# EAGLE design untitled (EAGLE 8.2.2)
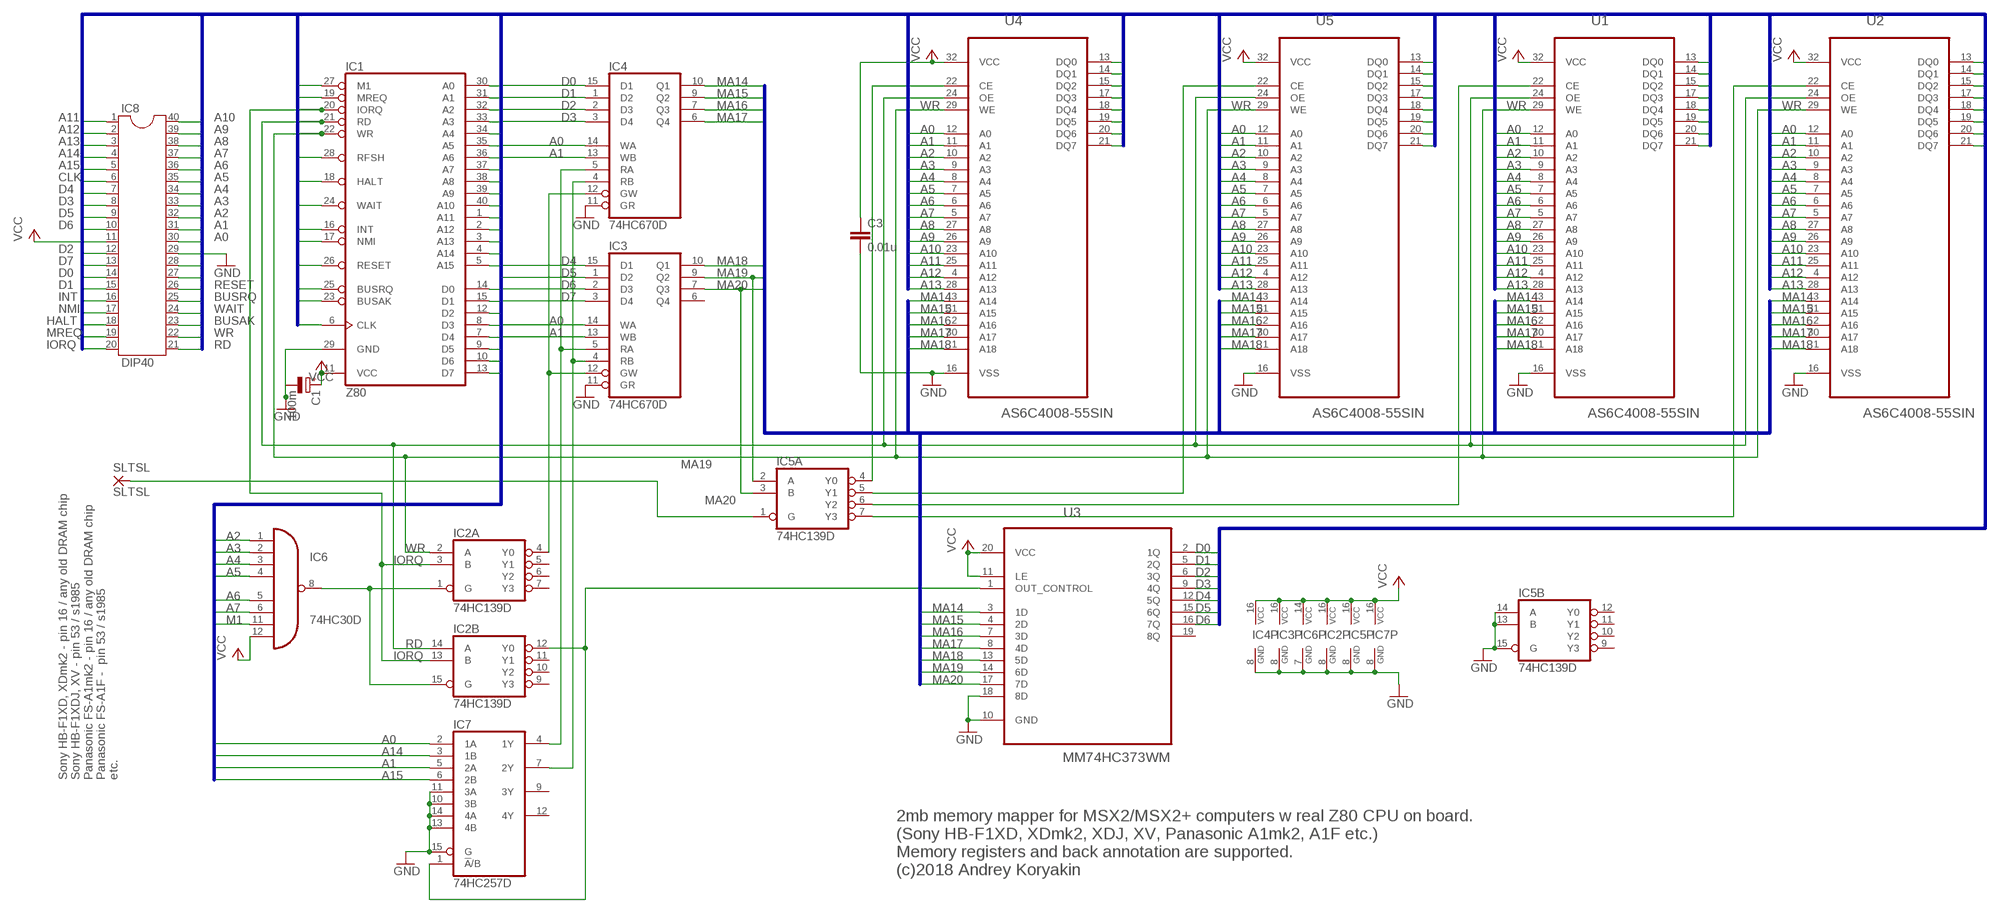
[diagram p0: schematic, sheet 1]

## Parts
C1  100m  CPOL-EUE2.5-5  [E2,5-5]
C3  0.01u  C2.5/2  [C2.5-2]
IC1  Z80  Z80CPU  [DIL40]
IC2  74HC139D  [SO16]
IC3  74HC670D  [SO16]
IC4  74HC670D  [SO16]
IC5  74HC139D  [SO16]
IC6  74HC30D  [SO14]
IC7  74HC257D  [SO16]
IC8  DIP40  DIL40  [DIL40]
SLTSL  SLTSL  WIREPAD1,6/0,8  [1,6/0,8]
U1  AS6C4008-55SIN  [SOIC127P1407X299-32N]
U2  AS6C4008-55SIN  [SOIC127P1407X299-32N]
U3  MM74HC373WM  [SOIC127P1032X265-20N]
U4  AS6C4008-55SIN  [SOIC127P1407X299-32N]
U5  AS6C4008-55SIN  [SOIC127P1407X299-32N]

## Nets
A0: IC1.30(A0) IC3.14(WA) IC4.14(WA) IC7.2(1A) IC8.30 U1.12(A0) U2.12(A0) U4.12(A0) U5.12(A0)
A1: IC1.31(A1) IC3.13(WB) IC4.13(WB) IC7.5(2A) IC8.31 U1.11(A1) U2.11(A1) U4.11(A1) U5.11(A1)
A2: IC1.32(A2) IC6.1(I0) IC8.32 U1.10(A2) U2.10(A2) U4.10(A2) U5.10(A2)
A3: IC1.33(A3) IC6.2(I1) IC8.33 U1.9(A3) U2.9(A3) U4.9(A3) U5.9(A3)
A4: IC1.34(A4) IC6.3(I2) IC8.34 U1.8(A4) U2.8(A4) U4.8(A4) U5.8(A4)
A5: IC1.35(A5) IC6.4(I3) IC8.35 U1.7(A5) U2.7(A5) U4.7(A5) U5.7(A5)
A6: IC1.36(A6) IC6.5(I4) IC8.36 U1.6(A6) U2.6(A6) U4.6(A6) U5.6(A6)
A7: IC1.37(A7) IC6.6(I5) IC8.37 U1.5(A7) U2.5(A7) U4.5(A7) U5.5(A7)
A8: IC1.38(A8) IC8.38 U1.27(A8) U2.27(A8) U4.27(A8) U5.27(A8)
A9: IC1.39(A9) IC8.39 U1.26(A9) U2.26(A9) U4.26(A9) U5.26(A9)
A10: IC1.40(A10) IC8.40 U1.23(A10) U2.23(A10) U4.23(A10) U5.23(A10)
A11: IC1.1(A11) IC8.1 U1.25(A11) U2.25(A11) U4.25(A11) U5.25(A11)
A12: IC1.2(A12) IC8.2 U1.4(A12) U2.4(A12) U4.4(A12) U5.4(A12)
A13: IC1.3(A13) IC8.3 U1.28(A13) U2.28(A13) U4.28(A13) U5.28(A13)
A14: IC1.4(A14) IC7.3(1B) IC8.4
A15: IC1.5(A15) IC7.6(2B) IC8.5
BUSAK: IC1.23(BUSAK) IC8.23
BUSRQ: IC1.25(BUSRQ) IC8.25
CLK: IC1.6(CLK) IC8.6
D0: IC1.14(D0) IC4.15(D1) IC8.14 U1.13(DQ0) U2.13(DQ0) U3.2(1Q) U4.13(DQ0) U5.13(DQ0)
D1: IC1.15(D1) IC4.1(D2) IC8.15 U1.14(DQ1) U2.14(DQ1) U3.5(2Q) U4.14(DQ1) U5.14(DQ1)
D2: IC1.12(D2) IC4.2(D3) IC8.12 U1.15(DQ2) U2.15(DQ2) U3.6(3Q) U4.15(DQ2) U5.15(DQ2)
D3: IC1.8(D3) IC4.3(D4) IC8.8 U1.17(DQ3) U2.17(DQ3) U3.9(4Q) U4.17(DQ3) U5.17(DQ3)
D4: IC1.7(D4) IC3.15(D1) IC8.7 U1.18(DQ4) U2.18(DQ4) U3.12(5Q) U4.18(DQ4) U5.18(DQ4)
D5: IC1.9(D5) IC3.1(D2) IC8.9 U1.19(DQ5) U2.19(DQ5) U3.15(6Q) U4.19(DQ5) U5.19(DQ5)
D6: IC1.10(D6) IC3.2(D3) IC8.10 U1.20(DQ6) U2.20(DQ6) U3.16(7Q) U4.20(DQ6) U5.20(DQ6)
D7: IC1.13(D7) IC3.3(D4) IC8.13 U1.21(DQ7) U2.21(DQ7) U4.21(DQ7) U5.21(DQ7)
GND [vcc]: C1.- C3.2 IC1.29(GND) IC2.8(P:GND) IC3.8(GND) IC3.11(GR) IC4.8(GND) IC4.11(GR) IC5.8(P:GND) IC5.13(B:B) IC5.14(B:A) IC5.15(B:G) IC6.7(GND) IC7.8(GND) IC7.10(3B) IC7.11(3A) IC7.13(4B) IC7.14(4A) IC7.15(G) IC8.29 U1.16(VSS) U2.16(VSS) U3.10(GND) U3.18(8D) U4.16(VSS) U5.16(VSS)
HALT: IC1.18(HALT) IC8.18
INT: IC1.16(INT) IC8.16
IORQ: IC1.20(IORQ) IC2.3(A:B) IC2.13(B:B) IC8.20
M1: IC1.27(M1) IC6.11(I6) IC8.27
MA14: IC4.10(Q1) U1.3(A14) U2.3(A14) U3.3(1D) U4.3(A14) U5.3(A14)
MA15: IC4.9(Q2) U1.31(A15) U2.31(A15) U3.4(2D) U4.31(A15) U5.31(A15)
MA16: IC4.7(Q3) U1.2(A16) U2.2(A16) U3.7(3D) U4.2(A16) U5.2(A16)
MA17: IC4.6(Q4) U1.30(A17) U2.30(A17) U3.8(4D) U4.30(A17) U5.30(A17)
MA18: IC3.10(Q1) U1.1(A18) U2.1(A18) U3.13(5D) U4.1(A18) U5.1(A18)
MA19: IC3.9(Q2) IC5.2(A:A) U3.14(6D)
MA20: IC3.7(Q3) IC5.3(A:B) U3.17(7D)
MREQ: IC1.19(MREQ) IC8.19
N$1: IC2.12(B:Y0) IC7.1(!A!/B) U3.1(OUT_CONTROL)
N$2: IC5.6(A:Y2) U1.22(CE)
N$3: IC5.7(A:Y3) U2.22(CE)
N$4: IC3.5(RA) IC4.5(RA) IC7.4(1Y)
N$5: IC5.4(A:Y0) U4.22(CE)
N$6: IC5.5(A:Y1) U5.22(CE)
N$7: IC3.4(RB) IC4.4(RB) IC7.7(2Y)
N$9: IC2.1(A:G) IC2.15(B:G) IC6.8(O)
N$12: IC2.4(A:Y0) IC3.12(GW) IC4.12(GW)
N$13: IC5.1(A:G) SLTSL.1(P)
NMI: IC1.17(NMI) IC8.17
RD: IC1.21(RD) IC2.14(B:A) IC8.21 U1.24(OE) U2.24(OE) U4.24(OE) U5.24(OE)
RESET: IC1.26(RESET) IC8.26
RFSH: IC1.28(RFSH) IC8.28
VCC [vcc]: C1.+ C3.1 IC1.11(VCC) IC2.16(P:VCC) IC3.16(VCC) IC4.16(VCC) IC5.16(P:VCC) IC6.12(I7) IC6.14(VCC) IC7.16(VCC) IC8.11 U1.32(VCC) U2.32(VCC) U3.11(LE) U3.20(VCC) U4.32(VCC) U5.32(VCC)
WAIT: IC1.24(WAIT) IC8.24
WR: IC1.22(WR) IC2.2(A:A) IC8.22 U1.29(WE) U2.29(WE) U4.29(WE) U5.29(WE)
Unconnected: IC2.5(A:Y1) IC2.6(A:Y2) IC2.7(A:Y3) IC2.9(B:Y3) IC2.10(B:Y2) IC2.11(B:Y1) IC3.6(Q4) IC5.9(B:Y3) IC5.10(B:Y2) IC5.11(B:Y1) IC5.12(B:Y0) IC7.9(3Y) IC7.12(4Y) U3.19(8Q)

## Buses
B$1,MA[14..20]
B$2,A[0..15],D[0..7],M1,MREQ,IORQ,RD,WR,RFSH,HALT,WAIT,INT,NMI,RESET,BUSRQ,BUSAK,CLK

## Notes on the sheet
- Sony HB-F1XD, XDmk2 - pin 16 / any old DRAM chip
  Sony HB-F1XDJ, XV - pin 53 / s1985
  Panasonic FS-A1mk2 - pin 16 / any old DRAM chip
  Panasonic FS-A1F -  pin 53 / s1985
  etc.
- 2mb memory mapper for MSX2/MSX2+ computers w real Z80 CPU on board.
  (Sony HB-F1XD, XDmk2, XDJ, XV, Panasonic A1mk2, A1F etc.)
  Memory registers and back annotation are supported.
  (c)2018 Andrey Koryakin

## Library data of the parts
C1 = resistor:CPOL-EU: POLARIZED CAPACITOR, European symbol
C3 = capacitor-wima:C: CAPACITOR naming: grid - package width
IC1 = zilog:Z80CPU: Z80 FAMILY DEVICE
IC2 IC5 = 74xx-eu:74*139: Dual 2-line to 4-line DECODER/DEMULTIPLEXER
IC3 IC4 = 74xx-eu:74*670: 4 by 4 REGISTER FILES, 3-state
IC6 = 74xx-eu:74*30: 8-input NAND gate
IC7 = 74xx-eu:74*257: Quadruple 2-to 1 line data SELECTOR/MULTIPLEXER
IC8 = ic-package:DIL40: Dual In Line
SLTSL = wirepad:WIREPAD: Wire PAD connect wire on PCB
U1 U2 U4 U5 = Alliance_Memory_By_element14_Batch_1:AS6C4008-55SIN: CMOS SRAM; MPN: AS6C4008-55SIN; OC_FARNELL: 1562901; OC_NEWARK: 94M6218; PACKAGE: SO-32; SUPPLIER: ALLIANCE MEMORY
U3 = Fairchild_By_element14_Batch_1:MM74HC373WM: 3-STATE Octal D-Type Latch; MPN: MM74HC373WM; OC_FARNELL: 1013976; OC_NEWARK: 78K6072; PACKAGE: SOIC-20; SUPPLIER: Fairchild

## Net classes
1 vcc: width 0.6 mm

## Board
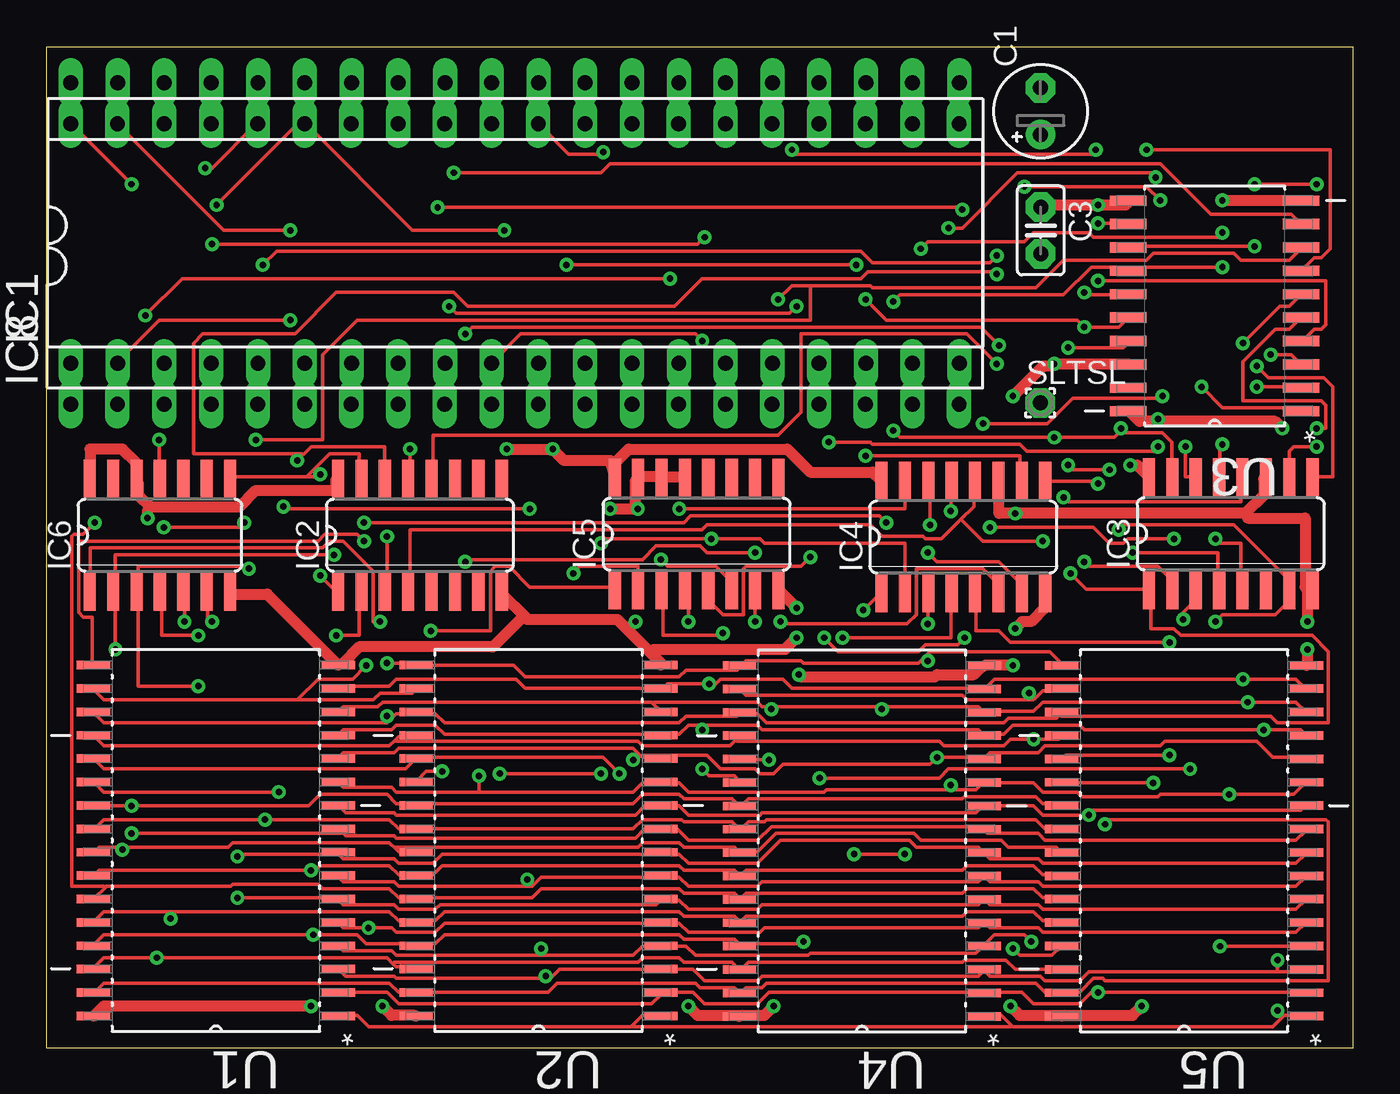
[diagram p1: board, top side]
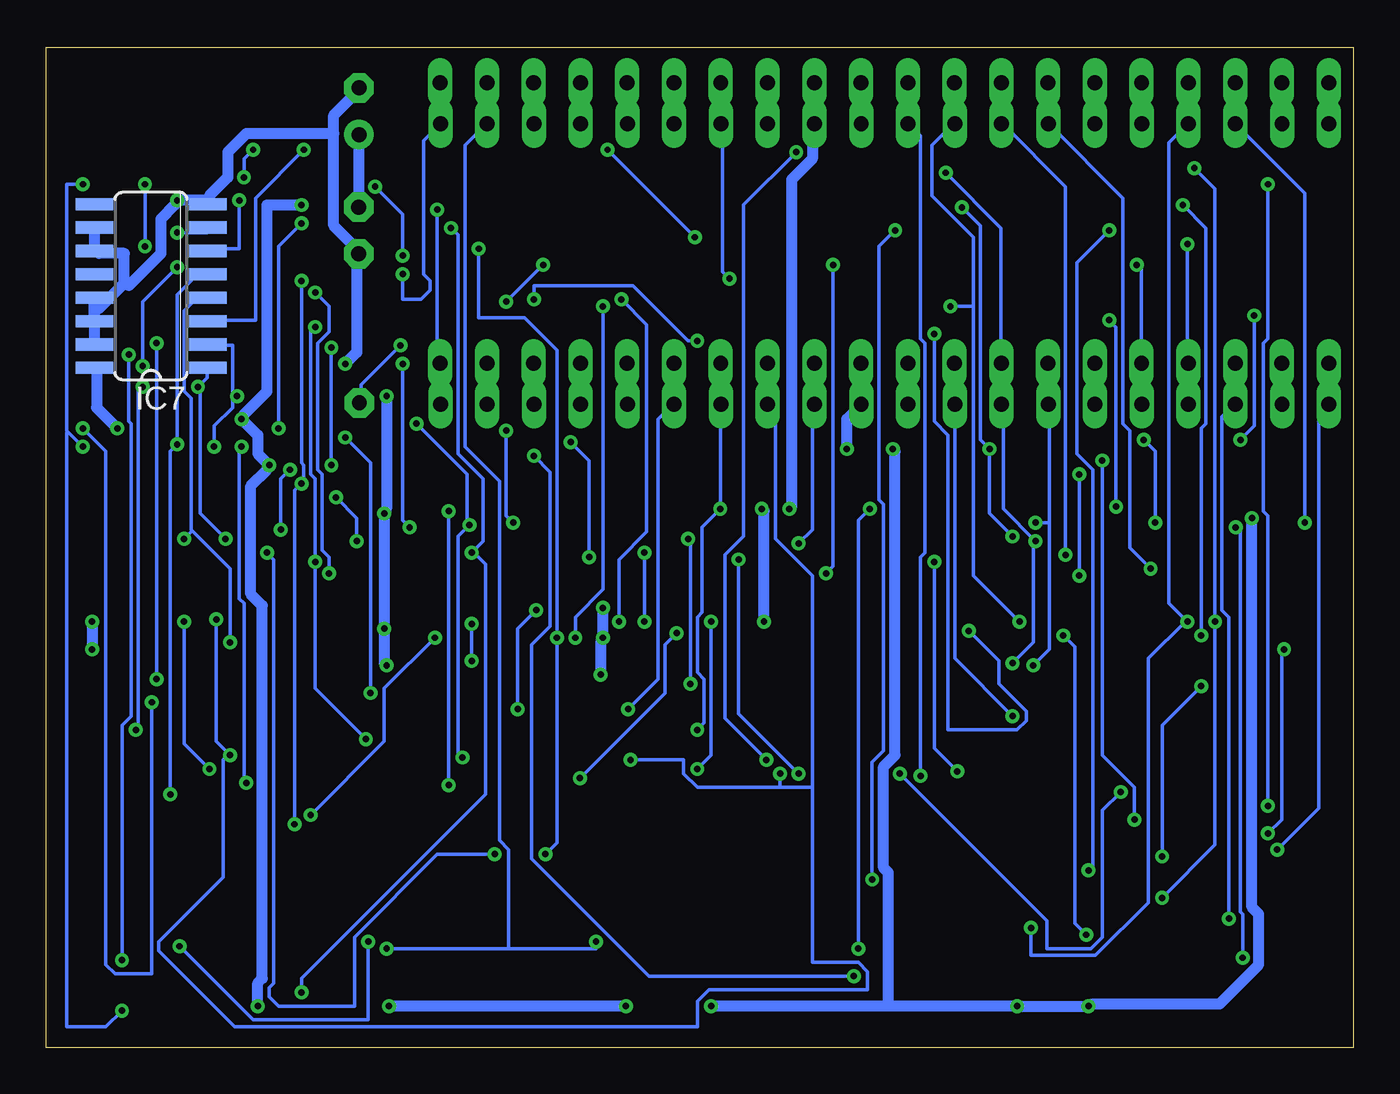
[diagram p2: board, bottom side, seen from below]

Size 71.02 x 54.32 mm. Coordinates in mm from the lower left corner, seen from the top.
Outline: 0.02,0 71.02,0 71,54.32 0,54.32 0.02,0
Copper layers (1*16): Top 0.035mm / dielectric 1.5mm / Bottom 0.035mm
Design rules "default *": minimum track width 7mil, minimum drill 0.35mm, track to track 7mil, track to pad 7mil, pad to pad 8mil, via to via 7mil, smd to smd 7mil, copper to edge 40mil, drill to drill 8mil, minimum pad ring 10mil, minimum via ring 8mil, stop-mask expansion 4mil, vias tented up to drill 0mil, thermal gap 10mil

### Footprints (pad centres in the part's own frame; a part is rotated, then mirrored left to right if it is on the bottom)
E2,5-5 = drill 0.813 pad 1.6: + -1.27,0 | drill 0.813 pad 1.6 octagon: - 1.27,0
C2.5-2 = drill 0.813 pad 1.6 octagon: 1 -1.27,0; 2 1.27,0
DIL40 = drill 0.813 long: 1 -24.13,-7.62; 2 -21.59,-7.62; 3 -19.05,-7.62; 4 -16.51,-7.62; 5 -13.97,-7.62; 6 -11.43,-7.62; 7 -8.89,-7.62; 8 -6.35,-7.62; 9 -3.81,-7.62; 10 -1.27,-7.62; 11 1.27,-7.62; 12 3.81,-7.62; 13 6.35,-7.62; 14 8.89,-7.62; 15 11.43,-7.62; 16 13.97,-7.62; 17 16.51,-7.62; 18 19.05,-7.62; 19 21.59,-7.62; 20 24.13,-7.62; 21 24.13,7.62; 22 21.59,7.62; 23 19.05,7.62; 24 16.51,7.62; 25 13.97,7.62; 26 11.43,7.62; 27 8.89,7.62; 28 6.35,7.62; 29 3.81,7.62; 30 1.27,7.62; 31 -1.27,7.62; 32 -3.81,7.62; 33 -6.35,7.62; 34 -8.89,7.62; 35 -11.43,7.62; 36 -13.97,7.62; 37 -16.51,7.62; 38 -19.05,7.62; 39 -21.59,7.62; 40 -24.13,7.62
SO16 = smd 0.66 x 2.032: 1 -4.445,-3.073; 2 -3.175,-3.073; 3 -1.905,-3.073; 4 -0.635,-3.073; 5 0.635,-3.073; 6 1.905,-3.073; 7 3.175,-3.073; 8 4.445,-3.073; 9 4.445,3.073; 10 3.175,3.073; 11 1.905,3.073; 12 0.635,3.073; 13 -0.635,3.073; 14 -1.905,3.073; 15 -3.175,3.073; 16 -4.445,3.073
SO14 = smd 0.66 x 2.032: 1 -3.81,-3.073; 2 -2.54,-3.073; 3 -1.27,-3.073; 4 0,-3.073; 5 1.27,-3.073; 6 2.54,-3.073; 7 3.81,-3.073; 8 3.81,3.073; 9 2.54,3.073; 10 1.27,3.073; 11 0,3.073; 12 -1.27,3.073; 13 -2.54,3.073; 14 -3.81,3.073
1,6/0,8 = drill 0.813 pad 1.6 octagon: 1 0,0
SOIC127P1407X299-32N = smd 1.803 x 0.457: 1 -6.655,9.525; 2 -6.655,8.255; 3 -6.655,6.985; 4 -6.655,5.715; 5 -6.655,4.445; 6 -6.655,3.175; 7 -6.655,1.905; 8 -6.655,0.635; 9 -6.655,-0.635; 10 -6.655,-1.905; 11 -6.655,-3.175; 12 -6.655,-4.445; 13 -6.655,-5.715; 14 -6.655,-6.985; 15 -6.655,-8.255; 16 -6.655,-9.525; 17 6.655,-9.525; 18 6.655,-8.255; 19 6.655,-6.985; 20 6.655,-5.715; 21 6.655,-4.445; 22 6.655,-3.175; 23 6.655,-1.905; 24 6.655,-0.635; 25 6.655,0.635; 26 6.655,1.905; 27 6.655,3.175; 28 6.655,4.445; 29 6.655,5.715; 30 6.655,6.985; 31 6.655,8.255; 32 6.655,9.525
SOIC127P1032X265-20N = smd 1.981 x 0.559: 1 -4.699,5.715; 2 -4.699,4.445; 3 -4.699,3.175; 4 -4.699,1.905; 5 -4.699,0.635; 6 -4.699,-0.635; 7 -4.699,-1.905; 8 -4.699,-3.175; 9 -4.699,-4.445; 10 -4.699,-5.715; 11 4.699,-5.715; 12 4.699,-4.445; 13 4.699,-3.175; 14 4.699,-1.905; 15 4.699,-0.635; 16 4.699,0.635; 17 4.699,1.905; 18 4.699,3.175; 19 4.699,4.445; 20 4.699,5.715

### Placement (x,y rotation side)
C1  54.02,50.84 90 top
C3  54.03,44.37 270 top
IC1  25.48,44.78 0 top
IC2  20.31,27.82 0 top
IC3  64.35,27.9 0 top
IC4  49.83,27.73 0 top
IC5  35.34,27.88 0 top
IC6  6.19,27.82 0 top
IC7  65.31,41.35 90 bottom
IC8  25.47,42.55 0 top
SLTSL  54,35 0 top
U1  9.23,11.24 180 top
U2  26.75,11.24 180 top
U3  63.48,40.27 180 top
U4  44.32,11.22 180 top
U5  61.82,11.23 180 top

### Tracks (layer width: path | path; a pad name or v marks a point on that pad's centre or on a via)
A0  (via drill 0.35)
  Top 0.178: v61.9,32.62 61.9,31 62.4,31 IC3.14 | U5.12 68.39,15.75 66.64,15.75 65.77,16.62 60.77,16.62 60.52,16.38 54.27,16.38 53.9,16 51.27,16 51.02,15.75 U4.12 50.9,15.75 v48.4,15.75 48.02,15.38 40.02,15.38 39.52,14.88 38.77,14.88 38.52,15.12 36.65,15.12 35.9,15.88 32.4,15.88 32.33,15.81 | v48.02,28.38 48.02,30.75 IC4.14 | v60.65,35.38 60.52,35.25 55.77,35.25 54.4,33.88 v50.9,33.88 | IC1.30 26.77,52.38 26.77,50.25 IC8.30 26.77,50.12 28.39,48.5 30.14,48.5 v30.27,48.62 | 32.33,15.81 32.4,15.75 33.4,15.75 U2.12 | 32.33,15.81 32.21,15.94 | 32.21,15.94 31.89,16.25 19.14,16.25 18.89,16 16.14,16 15.89,15.75 U1.12 | 32.21,15.94 v31.89,15.62
  Bottom 0.178: 60.9,35.38 60.9,34.75 61.9,33.75 v61.9,32.62 | 60.9,35.38 60.9,38.12 62.15,38.12 IC7.2 | v48.4,15.75 48.65,16 48.65,27.75 v48.02,28.38 48.15,28.38 48.15,31.12 v50.9,33.88 | v60.65,35.38 60.9,35.38 | v30.27,48.62 33.15,45.75 33.15,27.75 34.15,26.75 34.15,17.88 v31.89,15.62
A1  (via drill 0.35)
  Top 0.178: v63.9,32.75 63.77,32.75 63.77,31 IC3.13 | IC8.31 24.27,50.25 24.27,52.38 IC1.31 | 23.52,13.88 31.89,13.88 32.4,14.38 33.4,14.38 U2.11 33.52,14.38 34.4,14.38 34.9,13.88 42.27,13.88 42.4,14 49.15,14 | 23.52,13.88 19.02,13.88 18.77,14.12 16.14,14.12 15.89,14.38 U1.11 | 49.15,14 50.52,14 50.9,14.38 U4.11 51.02,14.38 53.65,14.38 54.15,13.88 56.02,13.88 56.27,13.62 60.4,13.62 60.52,13.75 v64.27,13.75 67.77,13.75 68.39,14.38 U5.11 | v49.15,29.12 49.15,30.75 IC4.13 | 49.15,14 v49.15,14.25 | 23.52,13.88 v23.52,14.75
  Bottom 0.178: IC7.5 62.27,41.88 62.9,41.88 63.9,40.88 v63.9,32.75 64.27,32.38 v64.27,13.75 | v49.15,14.25 v49.15,29.12 | v23.52,14.75 23.52,26.62 23.27,26.88 23.27,38.25 23.52,38.5 23.52,49.5 24.14,50.12 IC8.31
A2  (via drill 0.35)
  Top 0.178: v18.14,23.12 17.77,23.12 17.77,25.88 16.14,27.5 15.39,27.5 15.02,27.12 2.4,27.12 2.4,24.75 IC6.1 | IC1.32 21.64,52.38 21.64,50.25 IC8.32 | U1.10 15.89,13.12 16.27,12.75 18.89,12.75 19.02,12.62 32.02,12.62 32.52,13.12 33.4,13.12 U2.10 33.52,13.12 34.4,13.12 34.9,12.62 38.77,12.62 38.9,12.75 50.52,12.75 50.9,13.12 U4.10 53.65,13.12 54.15,12.62 56.27,12.62 56.46,12.81 | 56.46,12.81 56.52,12.88 68.14,12.88 68.39,13.12 U5.10 | v21.89,40.25 22.27,39.88 40.4,39.88 v40.77,40.25 | v42.27,22.25 43.02,21.5 47.4,21.5 47.77,21.88 49.52,21.88 v49.9,22.25 | 56.46,12.81 v56.65,12.62
  Bottom 0.178: v18.14,23.12 20.64,25.62 20.64,40.25 | 20.64,40.25 20.64,44 22.89,46.25 22.89,49 21.77,50.12 IC8.32 | v21.89,40.25 20.64,40.25 | v40.77,40.25 40.77,24.88 42.27,23.38 v42.27,22.25 | v49.9,22.25 52.65,19.5 52.65,16.62 v56.65,12.62
A3  (via drill 0.35)
  Top 0.178: v15.64,26.75 3.77,26.75 3.77,24.75 IC6.2 3.77,24.62 v3.77,21.62 | IC1.33 19.14,52.38 19.14,50.25 IC8.33 | U5.9 68.39,11.75 67.89,11.25 54.27,11.25 53.9,11.62 51.15,11.62 51.02,11.75 U4.9 50.9,11.88 50.77,12 39.4,12 38.65,11.25 34.9,11.25 34.27,11.88 U2.9 32.52,11.88 32.02,11.38 19.02,11.38 18.89,11.5 16.27,11.5 16.08,11.69 | 16.08,11.69 15.89,11.88 U1.9 | v4.64,11.62 16.02,11.62 16.08,11.69
  Bottom 0.178: v15.64,26.75 15.64,46.75 19.02,50.12 IC8.33 | v3.77,21.62 3.9,21.5 3.9,12.38 v4.64,11.62
A4  (via drill 0.35)
  Top 0.178: v11.02,26 10.89,26.12 5.02,26.12 5.02,24.75 IC6.3 5.02,24.62 5.02,19.62 v8.27,19.62 | IC1.34 16.64,52.38 16.64,50.25 IC8.34 | U5.8 68.39,10.5 67.89,10 54.15,10 53.9,10.25 51.27,10.25 51.02,10.5 U4.8 50.9,10.62 50.65,10.88 47.27,10.88 46.9,11.25 39.9,11.25 38.65,10 34.9,10 34.4,10.5 33.52,10.5 U2.8 33.4,10.5 21.52,10.5 21.02,10 19.14,10 18.89,10.25 16.14,10.25 15.89,10.5 U1.8 15.77,10.5 10.52,10.5 v10.39,10.38
  Bottom 0.178: v11.02,26 12.14,27.12 12.14,33.5 12.52,33.88 12.52,46.12 16.52,50.12 IC8.34 | v8.27,19.62 10.39,17.5 v10.39,10.38
A5  (via drill 0.35)
  Top 0.178: v8.27,22.38 6.27,22.38 6.27,24.62 IC6.4 | v9.27,45.75 13.64,50.12 14.02,50.12 IC8.35 | IC1.35 14.02,52.38 14.02,50.25 IC8.35 | U5.7 68.39,9.25 67.89,8.75 54.15,8.75 53.9,9 51.27,9 51.02,9.25 U4.7 50.9,9.25 50.65,9 38.9,9 38.65,8.75 34.9,8.75 34.4,9.25 33.52,9.25 U2.7 33.4,9.25 26.89,9.25 26.46,8.81 | 26.46,8.81 26.39,8.75 19.14,8.75 18.89,9 16.14,9 15.89,9.25 U1.7 | v24.89,44.38 19.89,44.38 14.14,50.12 IC8.35 | 26.46,8.81 v26.14,9.12
  Bottom 0.178: v8.27,22.38 8.27,33.62 8.02,33.88 8.02,44.5 v9.27,45.75 | v24.89,44.38 25.77,43.5 25.77,29.75 25.52,29.5 25.52,16.12 26.14,15.5 v26.14,9.12
A6  (via drill 0.35)
  Top 0.178: U5.6 68.39,8 67.89,7.5 54.15,7.5 53.9,7.75 51.27,7.75 51.02,8 U4.6 50.9,8 50.65,7.75 38.9,7.75 38.65,7.5 34.9,7.5 34.4,8 33.52,8 U2.6 33.4,8 33.15,7.75 21.39,7.75 21.14,7.5 19.14,7.5 18.89,7.75 16.14,7.75 15.89,8 U1.6 15.77,8.12 v10.39,8.12 | IC1.36 11.52,52.38 11.52,50.25 IC8.36 11.39,50.12 9.02,47.75 v8.64,47.75 | v7.52,23.12 7.52,24.62 IC6.5
  Bottom 0.178: v10.39,8.12 7.52,11 v7.52,23.12 7.52,46.62 v8.64,47.75
A7  (via drill 0.35)
  Top 0.178: v9.02,23.12 8.77,23.12 8.77,24.62 IC6.6 | IC1.37 9.02,52.38 9.02,50.25 IC8.37 | U5.5 68.39,6.75 67.89,6.25 54.15,6.25 53.9,6.5 51.27,6.5 51.02,6.75 U4.5 50.9,6.75 50.65,6.5 39.02,6.5 38.77,6.25 34.9,6.25 34.4,6.75 33.52,6.75 U2.5 33.4,6.75 21.64,6.75 21.14,6.25 19.02,6.25 18.77,6.5 v17.52,6.5 16.14,6.5 15.89,6.75 U1.5
  Bottom 0.178: IC8.37 9.02,50.12 10.02,49.12 10.02,24.12 v9.02,23.12 9.14,23.12 11.14,21.12 11.14,7.88 14.02,5 17.52,5 v17.52,6.5
A8  (via drill 0.35)
  Top 0.178: U5.27 55.15,8.12 54.15,8.12 53.65,8.62 50.02,8.62 49.77,8.38 38.02,8.38 37.77,8.12 U4.27 37.65,8.12 37.4,8.38 34.65,8.38 34.4,8.62 26.89,8.62 26.39,8.12 20.14,8.12 U2.27 20.02,8.12 19.14,8.12 18.64,8.62 15.02,8.62 14.77,8.88 10.14,8.88 10.02,8.75 3.27,8.75 3.21,8.69 | IC8.38 6.39,50.25 6.39,52.38 IC1.38 | 3.21,8.69 2.65,8.12 U1.27 | v2.65,28.5 2.02,27.88 1.52,27.88 1.4,27.75 1.4,8.75 3.15,8.75 3.21,8.69
  Bottom 0.178: v2.65,28.5 2.65,46.38 6.39,50.12 IC8.38
A9  (via drill 0.35)
  Top 0.178: U5.26 55.15,9.38 54.15,9.38 53.65,9.88 50.02,9.88 49.77,9.62 38.02,9.62 37.77,9.38 U4.26 37.65,9.38 37.4,9.62 34.65,9.62 34.4,9.88 21.52,9.88 21.02,9.38 20.14,9.38 U2.26 20.02,9.38 19.14,9.38 18.64,9.88 14.89,9.88 14.64,9.62 v14.39,9.62 2.9,9.62 2.65,9.38 U1.26 | IC1.39 3.9,52.38 3.9,50.25 IC8.39 3.9,50.12 9.64,44.38 v13.27,44.38
  Bottom 0.178: v13.27,44.38 15.02,42.62 15.02,32.25 14.14,31.38 14.14,9.88 v14.39,9.62
A10  (via drill 0.35)
  Top 0.178: U5.23 55.15,13.25 54.15,13.25 53.77,13.62 49.9,13.62 49.77,13.5 38.15,13.5 37.77,13.12 U4.23 37.65,13.12 37.27,13.5 34.65,13.5 34.4,13.75 32.4,13.75 31.89,13.25 20.14,13.25 U2.23 20.02,13.25 19.02,13.25 18.52,13.75 14.89,13.75 14.27,13.12 v4.64,13.12 2.65,13.12 U1.23 | IC1.40 1.4,52.38 1.4,50.25 IC8.40 1.4,50.12 v4.64,46.88
  Bottom 0.178: v4.64,46.88 4.64,38.5 4.89,38.25 4.89,29.12 4.64,28.88 v4.64,13.12
A11  (via drill 0.35)
  Top 0.178: IC8.1 1.4,35 1.4,37.12 IC1.1 | 4.14,10.88 9.89,10.88 10.14,11.12 18.64,11.12 18.96,10.81 | 4.14,10.88 2.9,10.88 2.65,10.62 U1.25 | 18.96,10.81 19.14,10.62 20.02,10.62 U2.25 | 18.96,10.81 19.02,10.88 32.15,10.88 32.4,11.12 34.4,11.12 34.65,10.88 37.4,10.88 37.65,10.62 U4.25 37.77,10.62 38.65,10.62 39.65,11.62 47.15,11.62 47.52,11.25 51.9,11.25 52.27,10.88 54.9,10.88 55.15,10.62 U5.25 | 4.14,10.88 v4.14,10.75
  Bottom 0.178: IC8.1 1.9,34.38 1.9,13 v4.14,10.75
A12  (via drill 0.35)
  Top 0.178: IC8.2 3.9,35 3.9,37.12 IC1.2 3.9,37.25 6.14,39.5 v13.27,39.5 | 26.89,5 31.89,5 32.4,5.5 33.4,5.5 U2.4 33.52,5.5 34.77,5.5 35.27,5 41.4,5 41.52,5.12 50.52,5.12 50.9,5.5 U4.4 51.02,5.62 51.52,6.12 53.15,6.12 v53.52,5.75 | 26.89,5 19.02,5 18.77,5.25 16.14,5.25 15.89,5.5 U1.4 | v63.77,5.5 68.39,5.5 U5.4 | v12.89,29.38 13.02,29.25 v26.27,29.25 | 26.89,5 v26.89,5.38
  Bottom 0.178: v63.77,5.5 59.77,1.5 53.52,1.5 v53.52,5.75 | v13.27,39.5 12.89,39.12 v12.89,29.38 | v26.27,29.25 26.89,28.62 v26.89,5.38
A13  (via drill 0.35)
  Top 0.178: U5.28 55.15,6.88 54.15,6.88 53.65,7.38 50.02,7.38 49.77,7.12 38.02,7.12 37.77,6.88 U4.28 37.65,6.88 37.4,7.12 34.65,7.12 34.4,7.38 21.64,7.38 21.14,6.88 20.14,6.88 U2.28 20.02,6.88 19.14,6.88 18.64,7.38 6.77,7.38 | IC8.3 6.39,35 6.39,37.12 IC1.3 | 6.77,7.38 3.15,7.38 2.65,6.88 U1.28 | 6.77,7.38 v6.77,7
  Bottom 0.178: v6.77,7 6.77,23.38 7.14,23.75 7.14,34.25 6.52,34.88 IC8.3
A14  (via drill 0.35)
  Top 0.178: v57.02,48.75 56.77,48.5 40.77,48.5 v40.52,48.75 | v35.77,44 35.4,43.62 v9.02,43.62 | IC8.4 9.02,35 9.02,37.12 IC1.4
  Bottom 0.178: v57.02,48.75 59.65,46.12 59.65,39.5 62.15,39.5 IC7.3 | v35.77,44 v40.52,48.75 | v9.02,43.62 9.02,37.25 IC1.4
A15  (via drill 0.35)
  Top 0.178: v60.52,46 59.77,46.75 v53.15,46.75 | v51.65,43 51.27,42.62 44.9,42.62 44.27,43.25 12.52,43.25 v11.77,42.5 | IC8.5 11.52,35 11.52,37.12 IC1.5
  Bottom 0.178: v60.52,46 60.52,43.38 62.15,43.38 IC7.6 | v53.15,46.75 51.65,45.25 v51.65,43 | v11.77,42.5 11.52,42.25 11.52,37.25 IC1.5
BUSAK
  Top 0.178: IC8.23 44.52,52.38 IC1.23
BUSRQ
  Top 0.178: IC8.25 39.52,50.25 39.52,52.38 IC1.25
CLK
  Top 0.178: IC8.6 14.02,35 14.02,37.12 IC1.6
D0  (via drill 0.35)
  Top 0.178: v34.4,29.25 46.65,29.25 46.65,30.75 IC4.15 | IC1.14 34.4,37.12 34.4,35 IC8.14 | 35.65,17.5 34.9,17.5 34.4,17 33.52,17 U2.13 33.4,17 21.64,17 21.14,17.5 19.02,17.5 18.77,17.25 16.14,17.25 15.89,17 U1.13 | 35.65,17.5 38.65,17.5 38.9,17.25 50.65,17.25 50.9,17 U4.13 51.02,17 52.02,17 52.52,17.5 56.15,17.5 56.4,17.25 v66.14,17.25 68.14,17.25 68.39,17 U5.13 | v65.77,35.88 68.14,35.88 U3.2 | 35.65,17.5 v35.65,17.25
  Bottom 0.178: IC8.14 34.4,34.88 v34.4,29.25 35.4,28.25 35.4,23.62 35.65,23.38 35.65,20.38 35.27,20 35.27,17.62 v35.65,17.25 | v65.77,35.88 66.02,35.62 66.02,17.38 v66.14,17.25
D1  (via drill 0.35)
  Top 0.178: IC8.15 36.9,35 36.9,37.12 IC1.15 | 32.96,18.69 33.4,18.25 U2.14 | 32.96,18.69 32.9,18.75 18.27,18.75 18.02,18.5 16.14,18.5 15.89,18.25 U1.14 | 39.4,18.5 38.9,18.5 38.65,18.75 33.02,18.75 32.96,18.69 | 39.4,18.5 45.4,18.5 | 45.4,18.5 50.65,18.5 50.9,18.25 U4.14 51.02,18.25 53.65,18.25 54.15,18.75 v65.27,18.75 67.89,18.75 68.39,18.25 U5.14 | v69.02,33.62 69.52,33.62 69.52,34.88 69.27,35.12 65.02,35.12 65.02,37.25 66.77,39 67.52,39 68.14,39.62 U3.5 | v44.4,23.75 45.27,24.62 IC4.1 | 45.4,18.5 v45.4,18.38 | 39.4,18.5 v39.4,18.38
  Bottom 0.178: v69.02,33.62 67.77,32.38 67.77,4.5 67.27,4 65.27,4 v65.27,18.75 | v44.4,23.75 45.4,22.75 v45.4,18.38 | v39.4,18.38 37.77,20 37.77,34.12 37.02,34.88 IC8.15
D2  (via drill 0.35)
  Top 0.178: v30.14,27.38 30.39,27.62 v36.15,27.62 38.77,27.62 39.02,27.38 46.65,27.38 46.65,24.75 IC4.2 | IC1.12 29.27,37.12 29.27,35 IC8.12 | U1.15 15.89,19.5 16.02,19.62 18.64,19.62 19.02,20 25.52,20 26.02,19.5 U2.15 33.52,19.5 33.77,19.75 v36.02,19.75 36.4,19.75 36.65,20 40.02,20 40.52,19.5 50.9,19.5 U4.15 51.02,19.5 51.52,20 v65.02,20 67.89,20 68.39,19.5 U5.15 | v65.02,38.25 67.02,40.25 67.52,40.25 68.14,40.88 U3.6
  Bottom 0.178: v30.14,27.38 29.39,28.12 29.39,34.88 IC8.12 | v65.02,20 v65.02,38.25 | v36.15,27.62 36.02,27.5 v36.02,19.75
D3  (via drill 0.35)
  Top 0.178: 47.71,21.19 47.4,20.88 41.15,20.88 41.02,21 38.02,21 37.77,20.75 U4.17 37.65,20.62 37.52,20.5 34.77,20.5 34.4,20.12 26.02,20.12 25.39,20.75 20.14,20.75 U2.17 20.02,20.88 v18.52,20.88 | 47.71,21.19 48.02,21.5 54.52,21.5 55.15,20.88 U5.17 | v47.9,23 47.9,24.62 IC4.3 | 47.71,21.19 v47.9,21 | v17.27,27.5 16.89,27.88 15.14,27.88 14.77,27.5 1.77,27.5 1.77,23.62 2.02,23.38 2.52,23.38 2.52,20.88 U1.17 | v22.14,47.5 30.14,47.5 30.64,48 60.52,48 63.27,45.25 67.64,45.25 68.14,44.75 U3.9 | IC8.8 19.14,35 19.14,37.12 IC1.8
  Bottom 0.178: v47.9,21 v47.9,23 | IC8.8 19.02,34.88 19.02,29.25 v17.27,27.5 17.39,27.5 17.39,22 v18.52,20.88 | v22.14,47.5 19.14,44.5 19.14,37.25 IC1.8
D4  (via drill 0.35)
  Top 0.178: IC8.7 16.64,35 16.64,37.12 IC1.7 | 13.64,18.88 17.77,18.88 18.14,19.25 19.89,19.25 20.02,19.38 U2.18 | 13.64,18.88 3.15,18.88 2.65,19.38 U1.18 | v17.39,20.75 16.64,20 14.77,20 13.64,18.88 | v57.15,44.75 58.77,44.75 U3.12 | IC3.15 61.15,31 61.15,32.88 60.65,33.38 58.65,33.38 v58.4,33.62 58.4,33.5 58.02,33.12 v54.77,33.12 46.4,33.12 v46.02,33.5 | 53.71,18.94 54.15,19.38 55.15,19.38 U5.18 | 53.71,18.94 53.65,18.88 50.02,18.88 49.77,19.12 38.02,19.12 37.77,19.38 U4.18 | 53.71,18.94 v53.4,19.25 | v17.27,28.5 34.65,28.5 35.02,28.88 45.27,28.88 v45.65,28.5
  Bottom 0.178: 16.52,28.5 16.52,21.62 v17.39,20.75 | 16.52,28.5 16.52,34.88 IC8.7 | v57.15,44.75 58.4,43.5 v58.4,33.62 | v54.77,33.12 53.4,31.75 v53.4,19.25 | v17.27,28.5 16.52,28.5 | v45.65,28.5 46.02,28.88 v46.02,33.5
D5  (via drill 0.35)
  Top 0.178: v56.4,41 56.52,40.88 58.77,40.88 U3.15 | v55.65,25.75 56.52,24.88 59.9,24.88 IC3.1 60.02,24.75 60.02,22.75 61.27,22.75 61.65,22.38 68.77,22.38 69.64,21.5 69.64,17.62 66.89,17.62 66.52,18 55.15,18 U5.19 55.15,18.12 54.9,17.88 52.27,17.88 52.02,17.62 39.15,17.62 38.65,18.12 37.77,18.12 U4.19 37.65,18.12 37.52,18 34.77,18 34.4,17.62 21.64,17.62 21.14,18.12 20.14,18.12 U2.19 20.02,18.12 19.02,18.12 18.71,17.81 | IC8.9 21.64,35 21.64,37.12 IC1.9 | 18.71,17.81 18.52,17.62 3.15,17.62 2.65,18.12 U1.19 | 18.71,17.81 v18.52,18
  Bottom 0.178: v56.4,41 55.65,40.25 55.65,38.88 56.27,38.25 56.27,31.38 56.02,31.12 56.02,27 55.65,26.62 v55.65,25.75 | v18.52,18 21.64,21.12 21.64,34.88 IC8.9
D6  (via drill 0.35)
  Top 0.178: 18.96,16.69 19.14,16.88 20.02,16.88 U2.20 | 18.96,16.69 18.64,16.38 3.15,16.38 2.65,16.88 U1.20 | 37.46,16.69 37.15,16.38 32.4,16.38 32.15,16.62 19.02,16.62 18.96,16.69 | 37.46,16.69 37.65,16.88 U4.20 | U5.20 55.15,16.88 55.02,16.75 v53.65,16.75 52.4,16.75 52.02,16.38 48.77,16.38 48.52,16.62 37.52,16.62 37.46,16.69 | IC8.10 24.27,35 24.27,37.12 IC1.10 24.27,37.25 25.77,38.75 35.27,38.75 v35.65,38.38 | v56.4,26.38 56.65,26.12 60.4,26.12 61.15,25.38 61.15,24.88 IC3.2 | U3.16 58.27,39.12 v56.4,39.12 56.02,39.5 45.65,39.5 v44.52,40.62
  Bottom 0.178: v56.4,39.12 56.65,38.88 56.65,31.12 56.4,30.88 v56.4,26.38 56.4,19.5 v53.65,16.75 | v35.65,38.38 36.15,38.38 39.15,41.38 44.52,41.38 v44.52,40.62
D7  (via drill 0.35)
  Top 0.178: U1.21 2.65,15.62 3.15,15.12 19.52,15.12 20.02,15.62 U2.21 20.14,15.75 30.27,15.75 v31.14,14.88 | v61.02,15.88 55.4,15.88 55.27,15.75 U5.21 | v61.77,23.25 61.77,23.62 62.4,24.25 62.4,24.75 IC3.3 | v39.27,15.62 37.77,15.62 U4.21 | IC1.13 31.89,37.12 31.89,35 IC8.13
  Bottom 0.178: v61.77,23.25 61.77,16.62 v61.02,15.88 61.15,15.88 61.4,15.62 61.4,9.25 64.89,5.75 64.89,5.25 60.77,1.12 35.65,1.12 35.65,2.5 35.02,3.12 26.39,3.12 26.39,4.12 26.89,4.62 29.39,4.62 29.39,14.12 | v39.27,15.62 36.4,15.62 36.4,14.88 35.65,14.12 31.14,14.12 | 29.39,14.12 31.14,14.12 | 29.39,14.12 29.39,25.62 31.39,27.62 31.39,34.5 31.77,34.88 IC8.13 | 31.14,14.12 v31.14,14.88
GND  (via drill 0.35)
  Top 0.6: v52.52,20.75 51.02,20.75 U4.16 50.77,20.62 50.4,20.25 48.4,20.25 48.27,20.12 41.02,20.12 v40.9,20.25 | v52.65,22.75 53.02,23.12 53.52,23.12 54.27,23.88 54.27,24.62 IC4.8 | v68.52,21.62 68.52,20.88 U5.16 | 68.52,24.75 v68.52,23.12 | 68.52,24.75 68.77,24.75 IC3.8 | 65.14,29 v52.65,29 51.77,29 51.77,30.75 IC4.11 | 65.14,29 66.14,30 66.14,30.88 IC3.11 | 68.52,24.75 68.39,25 68.39,28.75 65.27,28.75 65.14,29 | v63.9,46 68.14,46 U3.10 | U3.18 58.77,37.12 v54.77,37.12 54.52,37 54.15,37 v52.52,35.38 | IC5.13 34.65,31 33.65,31 IC5.14 33.4,31 32.27,31 IC5.15 32.02,30.75 32.02,29.25 | IC8.29 29.27,50.25 29.27,52.38 IC1.29 | v30.64,29.25 32.02,29.25 | IC6.7 10.02,24.62 12.02,24.62 15.77,20.88 U1.16 16.14,20.88 17.02,21.75 24.27,21.75 25.96,23.44 | 31.58,22.69 31.02,23.25 26.14,23.25 25.96,23.44 | 31.58,22.69 32.83,21.44 | 32.83,21.44 33.4,20.88 U2.16 | 25.96,23.44 24.77,24.62 IC2.8 | v40.77,23.88 39.9,24.75 IC5.8 | v40.77,22.25 40.15,21.62 33.02,21.62 32.83,21.44 | 31.58,22.69 v32.02,23.12 | v32.15,29.25 32.02,29.25
  Bottom 0.6: v52.52,20.75 52.65,20.88 v52.65,22.75 v52.65,29 52.52,29.25 v52.52,35.38 | v68.52,23.12 v68.52,21.62 | 62.27,46 v63.9,46 64.02,45.75 64.77,45 64.77,43.12 66.52,41.38 66.77,41.5 | 62.27,46 62.27,45.88 IC7.8 | IC7.10 68.39,44.5 68.39,43.38 IC7.11 68.14,43.12 66.77,43.12 66.77,41.5 | IC7.15 68.39,38.25 68.39,39.38 IC7.14 68.39,39.75 68.39,40.12 | 68.39,40.12 68.39,40.62 IC7.13 | 66.77,41.5 68.14,40.12 68.39,40.12 | v54.77,37.12 54.15,37.75 54.15,43 C3.2 54.15,43.38 55.4,44.62 55.4,49.62 | 55.4,49.62 55.4,50.62 54.02,52 C1.- | 55.4,49.62 60.15,49.62 61.15,48.62 61.15,47.25 62.15,46.25 62.27,46 | v30.64,29.25 30.52,29.38 30.52,47.12 29.39,48.25 29.39,50.12 IC8.29 | v40.77,23.88 v40.77,22.25 40.9,22 v40.9,20.25 | v32.15,29.25 32.02,29.12 v32.02,23.12
HALT
  Top 0.178: IC8.18 44.52,37.12 IC1.18
INT
  Top 0.178: IC8.16 39.52,35 39.52,37.12 IC1.16
IORQ  (via drill 0.35)
  Top 0.178: IC8.20 49.65,35 49.65,37.12 IC1.20 | v18.52,27.75 18.52,24.75 IC2.3 | v19.77,32.5 19.77,31 IC2.13 | v49.77,45.5 49.65,45.62 v21.27,45.62
  Bottom 0.178: v18.52,27.75 19.77,29 v19.77,32.5 20.27,33 20.27,44.62 v21.27,45.62 | v49.77,45.5 49.77,37.38 49.65,37.25 IC1.20
M1  (via drill 0.35)
  Top 0.178: v6.14,33 6.14,31 IC6.11 | v5.39,39.75 7.39,41.75 v33.9,41.75 | IC1.27 34.4,52.38 34.4,50.25 IC8.27
  Bottom 0.178: v6.14,33 5.39,33.75 v5.39,39.75 | v33.9,41.75 34.27,42.12 34.27,50.12 IC8.27
MA14  (via drill 0.35)
  Top 0.178: 66.89,4.12 68.39,4.12 U5.3 | 66.89,4.12 56.65,4.12 56.15,3.62 54.27,3.62 54.02,3.88 51.27,3.88 51.02,4.12 U4.3 50.9,4.12 50.65,3.88 38.9,3.88 38.65,3.62 35.77,3.62 35.15,4.25 33.52,4.25 U2.3 27.89,4.25 27.39,3.75 27.14,3.75 | v66.52,37.62 67.64,37.62 68.14,37.12 U3.3 | 66.89,4.12 v66.89,4.75 | 27.14,3.75 19.02,3.75 18.89,3.88 16.27,3.88 15.89,4.25 U1.3 | v44.52,32.12 52.9,32.12 52.9,30.88 IC4.10 | 27.14,3.75 v27.14,3.88
  Bottom 0.178: v66.52,37.62 66.52,34 66.39,33.88 66.39,18 66.89,17.5 v66.89,4.75 | v44.52,32.12 43.65,31.25 43.65,22.88 44.65,21.88 44.65,10.25 38.27,3.88 v27.14,3.88
MA15  (via drill 0.35)
  Top 0.178: v57.15,41.62 69.52,41.62 69.52,39.25 69.27,39 68.89,39 68.27,38.38 U3.4 | v57.15,30.62 57.02,30.75 54.4,30.75 IC4.9 | U1.31 2.65,3 3.15,3.5 18.64,3.5 19.14,3 20.02,3 U2.31 20.14,3 27.27,3 27.77,3.5 35.27,3.5 35.52,3.25 37.4,3.25 37.65,3 U4.31 37.77,3 38.02,3.25 38.9,3.25 39.15,3.5 53.77,3.5 54.27,3 55.15,3 U5.31 55.27,3 56.15,3 56.9,3.75 57.4,3.75 57.52,3.62 69.64,3.62 69.64,12.25 69.52,12.38 57.77,12.38 v57.52,12.12
  Bottom 0.178: v57.15,41.62 57.15,31.75 57.02,31.62 57.02,30.75 v57.15,30.62 57.52,30.25 v57.52,12.12
MA16  (via drill 0.35)
  Top 0.178: v59.77,48.75 69.77,48.75 69.77,43.38 69.27,42.88 68.89,42.88 68.27,42.25 U3.7 | v60.27,47.25 60.02,47.5 52.77,47.5 49.77,44.5 v49.02,44.5 | v47.9,26.88 48.4,26.38 51.77,26.38 52.9,25.25 52.9,24.75 IC4.7 | U1.2 15.89,3 18.52,3 19.14,2.38 32.9,2.38 33.4,2.88 U2.2 33.52,3 35.15,3 35.77,2.38 38.65,2.38 39.27,3 50.9,3 U4.2 51.02,3 53.02,3 53.65,2.38 56.15,2.38 56.77,3 v57.15,3 68.39,3 U5.2
  Bottom 0.178: v59.77,48.75 60.27,48.25 v60.27,47.25 | v49.02,44.5 48.65,44.12 48.65,32.25 47.27,30.88 47.27,27.5 v47.9,26.88 47.77,26.88 47.15,26.25 47.15,13.75 57.15,3.75 v57.15,3
MA17  (via drill 0.35)
  Top 0.178: 41.52,41.38 40.52,41.38 v39.77,40.62 | 41.52,41.38 44.77,41.38 44.9,41.25 53.77,41.25 55.27,42.75 59.77,42.75 60.15,43.12 64.52,43.12 64.89,42.75 67.52,42.75 68.14,43.38 U3.8 | v39.9,23.12 40.02,23 46.77,23 47.27,23.5 47.27,26 50.9,26 51.65,25.25 51.65,24.75 IC4.6 | U5.30 55.15,4.25 52.65,4.25 52.15,4.75 49.9,4.75 49.77,4.62 38.15,4.62 37.77,4.25 U4.30 37.65,4.25 37.27,4.62 34.65,4.62 34.4,4.88 32.4,4.88 32.15,4.62 18.89,4.62 18.83,4.56 | 18.83,4.56 19.02,4.38 20.02,4.38 U2.30 | 18.83,4.56 18.52,4.88 v6.02,4.88 3.15,4.88 2.65,4.38 U1.30 | 41.52,41.38 41.52,39.5 16.89,39.5 15.02,37.62 15.02,33 v11.39,33 | v10.77,28.5 10.52,28.25 v6.39,28.25
  Bottom 0.178: v39.77,40.62 38.4,39.25 38.4,28 39.9,26.5 v39.9,23.12 | v11.39,33 10.77,32.38 v10.77,28.5 | v6.39,28.25 6.14,28 6.14,7.38 6.02,7.25 v6.02,4.88
MA18  (via drill 0.35)
  Top 0.178: 31.83,1.19 32.4,1.75 33.4,1.75 U2.1 | 31.83,1.19 31.77,1.12 17.52,1.12 16.89,1.75 15.89,1.75 U1.1 | 52.46,1.19 52.52,1.12 66.64,1.12 67.21,1.69 | 52.46,1.19 51.9,1.75 51.02,1.75 U4.1 | 67.21,1.69 67.27,1.75 68.39,1.75 U5.1 | v65.64,43.5 58.9,43.5 U3.13 | v69.02,46.88 v65.64,46.88 | v69.02,32.62 67.77,32.62 67.52,32.38 67.52,31 IC3.10 | v66.89,2 67.21,1.69 | 31.83,1.19 31.89,1.12 52.4,1.12 52.46,1.19
  Bottom 0.178: v65.64,46.88 v65.64,43.5 | v69.02,46.88 69.89,46.88 69.89,33.5 69.83,33.44 | v69.02,32.62 69.83,33.44 | v66.89,2 67.77,1.12 69.89,1.12 69.89,33.38 69.83,33.44
MA19  (via drill 0.35)
  Top 0.178: v63.9,42.38 59.02,42.38 58.9,42.25 U3.14 58.9,42.38 56.77,42.38 55.27,40.88 46.4,40.88 v46.02,40.5 | v65.77,37 66.39,36.38 69.39,36.38 69.89,35.88 69.89,31 68.89,31 IC3.9 | v28.64,25.75 29.02,26.12 32.15,26.12 32.15,24.88 IC5.2 | v44.02,42.5 v28.27,42.5
  Bottom 0.178: v63.9,42.38 65.77,40.5 v65.77,37 | v28.64,25.75 28.27,26.12 v28.27,42.5 | v46.02,40.5 v44.02,42.5
MA20  (via drill 0.35)
  Top 0.178: v55.52,38 58.52,38 58.77,38.25 U3.17 | v55.52,31.62 55.77,31.38 v57.77,31.38 | v58.27,28.12 58.52,28.38 64.52,28.38 67.52,25.38 67.52,24.88 IC3.7 67.52,24.75 67.52,24.25 66.77,23.5 63.9,23.5 v63.52,23.12 | v36.77,22.5 36.65,22.38 33.52,22.38 33.52,24.75 IC5.3 | v42.02,14.62 48.52,14.62 49.02,15.12 v62.15,15.12
  Bottom 0.178: v55.52,31.62 v55.52,38 | v57.77,31.38 58.27,30.88 v58.27,28.12 | v36.77,22.5 37.4,21.88 37.4,19.25 v42.02,14.62 | v62.15,15.12 63.52,16.5 v63.52,23.12
MREQ
  Top 0.178: IC8.19 47.15,35 47.15,37.12 IC1.19
N$1  (via drill 0.35)
  Top 0.178: v62.77,35.88 63.9,34.75 68.02,34.75 68.14,34.62 U3.1 | v51.65,37.12 50.02,38.75 41.02,38.75 41.02,34.5 39.77,33.25 21.02,33.25 21.02,31 IC2.12 | v51.27,28.25 56.9,28.25 57.77,27.38 58.52,27.38 58.77,27.62 v61.27,27.62
  Bottom 0.178: IC7.1 62.27,36.88 62.27,36.38 v62.77,35.88 62.65,35.88 62.65,29 v61.27,27.62 | v51.65,37.12 51.65,28.62 v51.27,28.25
N$2  (via drill 0.35)
  Top 0.178: v12.64,13.88 3.15,13.88 2.65,14.38 U1.22 | v30.14,14.88 v24.64,14.88 | v33.4,26.5 33.77,26.12 36.4,26.12 37.15,25.38 37.15,24.88 IC5.6
  Bottom 0.178: v12.64,13.88 13.64,12.88 13.64,6 14.27,5.38 16.64,5.38 16.64,6.88 v24.64,14.88 | v30.14,14.88 33.4,18.12 v33.4,26.5
N$3  (via drill 0.35)
  Top 0.178: v21.52,15 20.64,15 20.14,14.5 U2.22 | v22.77,26.38 22.89,26.5 32.4,26.5 33.15,27.25 35.52,27.25 35.9,26.88 v38.52,26.88 | v38.52,23.12 38.52,24.75 IC5.7
  Bottom 0.178: v21.52,15 22.77,16.25 v22.77,26.38 | v38.52,23.12 v38.52,26.88
N$4  (via drill 0.35)
  Top 0.178: v61.02,22 52.4,22 51.77,22.62 50.52,22.62 50.52,24.62 IC4.5 | v63.52,27.62 63.77,27.38 64.89,27.38 64.89,24.88 IC3.5
  Bottom 0.178: v61.02,22 61.02,26 63.08,28.06 | 63.08,28.06 63.15,28.12 63.15,35.25 63.52,35.62 63.52,40 62.9,40.62 62.27,40.62 IC7.4 | 63.08,28.06 v63.52,27.62
N$5  (via drill 0.35)
  Top 0.178: v35.65,15.12 36.02,14.75 37.4,14.75 37.65,14.5 U4.22 | v34.9,23.12 34.9,24.75 34.77,24.75 IC5.4
  Bottom 0.178: v35.65,15.12 34.9,15.88 v34.9,23.12
N$6  (via drill 0.35)
  Top 0.178: v60.15,14.38 55.27,14.38 U5.22 | v60.4,32.62 60.15,32.38 53.27,32.38 52.9,32.75 44.9,32.75 44.77,32.88 v42.52,32.88 | v41.52,26.62 41.02,26.12 38.02,26.12 37.9,26 37.9,23.5 36.77,23.5 36.02,24.25 36.02,24.75 IC5.5
  Bottom 0.178: v60.15,14.38 60.27,14.5 60.27,24.12 60.52,24.38 60.52,32.5 v60.4,32.62 | v42.52,32.88 41.52,31.88 v41.52,26.62
N$7  (via drill 0.35)
  Top 0.178: v43.27,22.25 49.15,22.25 49.15,24.62 IC4.4 | v47.52,43.38 47.9,43.75 53.15,43.75 53.65,44.25 56.65,44.25 56.9,44 63.65,44 v63.9,44.25 | v59.02,26.88 63.65,26.88 63.65,24.88 IC3.4 | v43.9,10.5 v46.65,10.5
  Bottom 0.178: v47.52,43.38 47.52,39.62 45.02,39.62 43.27,37.88 v43.27,22.25 43.27,11.12 v43.9,10.5 | v63.9,44.25 62.27,44.25 62.27,44.5 IC7.7 | v59.02,26.88 58.65,26.5 58.65,3.5 58.9,3.25 58.9,2.75 58.4,2.25 54.27,2.25 54.27,6 49.77,10.5 v46.65,10.5
N$9  (via drill 0.35)
  Top 0.178: v14.89,25.62 15.77,24.75 IC2.1 | v14.89,31.12 14.77,31 14.14,31 | 14.14,31 10.02,31 IC6.8 | 14.14,31 15.39,32.25 17.02,32.25 17.02,31 IC2.15
  Bottom 0.178: v14.89,31.12 v14.89,25.62
N$12  (via drill 0.35)
  Top 0.178: 49.71,28.69 50.4,29.38 50.4,30.75 IC4.12 | 49.71,28.69 48.65,27.62 47.77,27.62 47.65,27.75 45.4,27.75 44.77,28.38 35.9,28.38 35.65,28.12 19.77,28.12 19.77,24.75 IC2.4 | v55.27,29.88 55.52,29.62 64.89,29.62 64.89,30.88 IC3.12 | v54.15,27.5 50.9,27.5 49.71,28.69
  Bottom 0.178: v55.27,29.88 54.15,28.75 v54.15,27.5
N$13  (via drill 0.35)
  Top 0.178: v20.89,22.62 24.14,22.62 24.14,25.88 24.39,26.12 25.14,26.12 26.27,25 30.77,25 30.89,24.88 IC5.1 | v22.77,38.75 23.14,39.12 50.77,39.12 v51.77,38.12
  Bottom 0.178: v20.89,22.62 19.27,21 19.27,19.75 17.77,18.25 17.77,17.75 18.27,17.25 22.02,17.25 22.02,33.25 22.77,34 v22.77,38.75 | v51.77,38.12 53.9,36 53.9,35 SLTSL.1
NMI
  Top 0.178: IC8.17 42.02,35 42.02,37.12 IC1.17
RD  (via drill 0.35)
  Top 0.178: U5.24 55.15,11.88 54.27,11.88 53.77,12.38 39.15,12.38 39.02,12.25 38.15,12.25 37.77,11.88 U4.24 37.65,11.88 37.27,12.25 34.65,12.25 34.52,12.38 32.4,12.38 31.89,11.88 U2.24 19.14,11.88 18.64,12.38 v11.89,12.38 3.15,12.38 2.65,11.88 U1.24 | IC8.21 49.65,50.25 49.65,52.38 IC1.21 | v13.64,31.88 13.96,32.19 | 13.96,32.19 14.39,32.62 18.39,32.62 18.39,31 IC2.14 | v51.65,42 51.52,42.12 44.65,42.12 44.27,41.75 35.65,41.75 34.15,40.25 22.89,40.25 22.14,41 15.77,41 13.52,38.75 8.52,38.75 8.02,38.25 8.02,32.25 13.89,32.25 13.96,32.19
  Bottom 0.178: v13.64,31.88 13.64,15.88 11.89,14.12 v11.89,12.38 | IC8.21 50.52,49.25 50.52,42 50.15,41.62 50.15,41.12 50.65,40.62 51.65,40.62 v51.65,42
RESET
  Top 0.178: IC8.26 36.9,50.25 36.9,52.38 IC1.26
RFSH
  Top 0.178: IC8.28 31.89,50.25 31.89,52.38 IC1.28
VCC  (via drill 0.35)
  Top 0.6: U3.11 58.77,45.88 58.65,45.75 v57.15,45.75 54.15,45.75 C3.1 | 60.4,34 66.77,34 v67.14,33.62 | 60.4,34 59.4,34 58.9,34.5 U3.20 | v58.9,31.62 59.27,31.62 59.9,31 IC3.16 | v60.4,34.12 60.4,34 | IC8.11 26.77,35 26.77,37.12 IC1.11 | IC4.16 45.27,30.88 44.9,31.25 41.52,31.25 40.27,32.5 31.64,32.5 30.89,31.75 IC5.16 30.64,31.88 28.14,31.88 v27.52,32.5 v25.02,32.5 | IC6.14 2.4,31 2.4,32.5 4.14,32.5 4.89,31.75 4.89,31 IC6.12 5.02,30.62 5.02,30 5.64,29.38 | 5.64,29.38 10.52,29.38 11.39,30.25 15.77,30.25 15.77,30.88 IC2.16 | v14.39,2.25 3.15,2.25 2.65,1.75 U1.32 | v18.27,2.25 18.77,1.75 20.02,1.75 U2.32 | v34.9,2.25 35.4,1.75 37.65,1.75 U4.32 37.9,1.75 39.02,1.75 v39.52,2.25 | v52.4,2.25 52.9,1.75 55.15,1.75 U5.32 55.4,1.75 59.02,1.75 v59.52,2.25 | v5.52,28.75 5.52,29.12 5.64,29.38
  Bottom 0.6: C1.+ 54.02,45.75 C3.1 | v67.14,33.62 68.27,34.75 68.27,36.88 IC7.16 | v57.15,45.75 59.02,45.75 59.02,35.62 60.27,34.38 v60.4,34.12 59.52,33.25 59.52,32.25 v58.9,31.62 59.02,31.38 59.9,30.5 59.9,24.62 59.27,24 59.27,3.75 59.52,3.5 v59.52,2.25 | v27.52,32.5 27.52,34.12 26.77,34.88 IC8.11 | 25.27,2.25 v18.27,2.25 v14.39,2.25 14.14,2.38 7.27,2.38 5.14,4.5 5.14,7.25 5.52,7.62 v5.52,28.75 | 25.27,2.25 v34.9,2.25 | v39.52,2.25 v52.4,2.25 | v25.02,32.5 24.89,32.38 24.89,15.88 25.52,15.25 25.52,9.75 25.27,9.5 25.27,2.25
WAIT
  Top 0.178: IC8.24 42.02,50.25 42.02,52.38 IC1.24
WR  (via drill 0.35)
  Top 0.178: IC8.22 47.15,50.25 47.15,52.38 IC1.22 | v52.52,5.38 52.9,5 54.65,5 55.15,5.5 U5.29 | v41.15,5.75 41.02,5.62 37.77,5.62 U4.29 37.65,5.62 37.4,5.88 34.65,5.88 34.4,6.12 21.64,6.12 21.14,5.62 20.14,5.62 U2.29 20.02,5.62 17.39,5.62 16.89,6.12 v14.52,6.12 3.15,6.12 2.65,5.62 U1.29 | v15.77,22.38 17.02,22.38 17.02,24.62 IC2.2
  Bottom 0.178: 45.9,5.38 41.15,5.38 v41.15,5.75 | 45.9,5.38 v52.52,5.38 | v15.77,22.38 15.14,21.75 15.14,6.75 v14.52,6.12 | 45.9,5.38 45.9,10.75 46.4,11.25 46.4,30.75 48.27,32.62 48.27,49 47.15,50.12 IC8.22